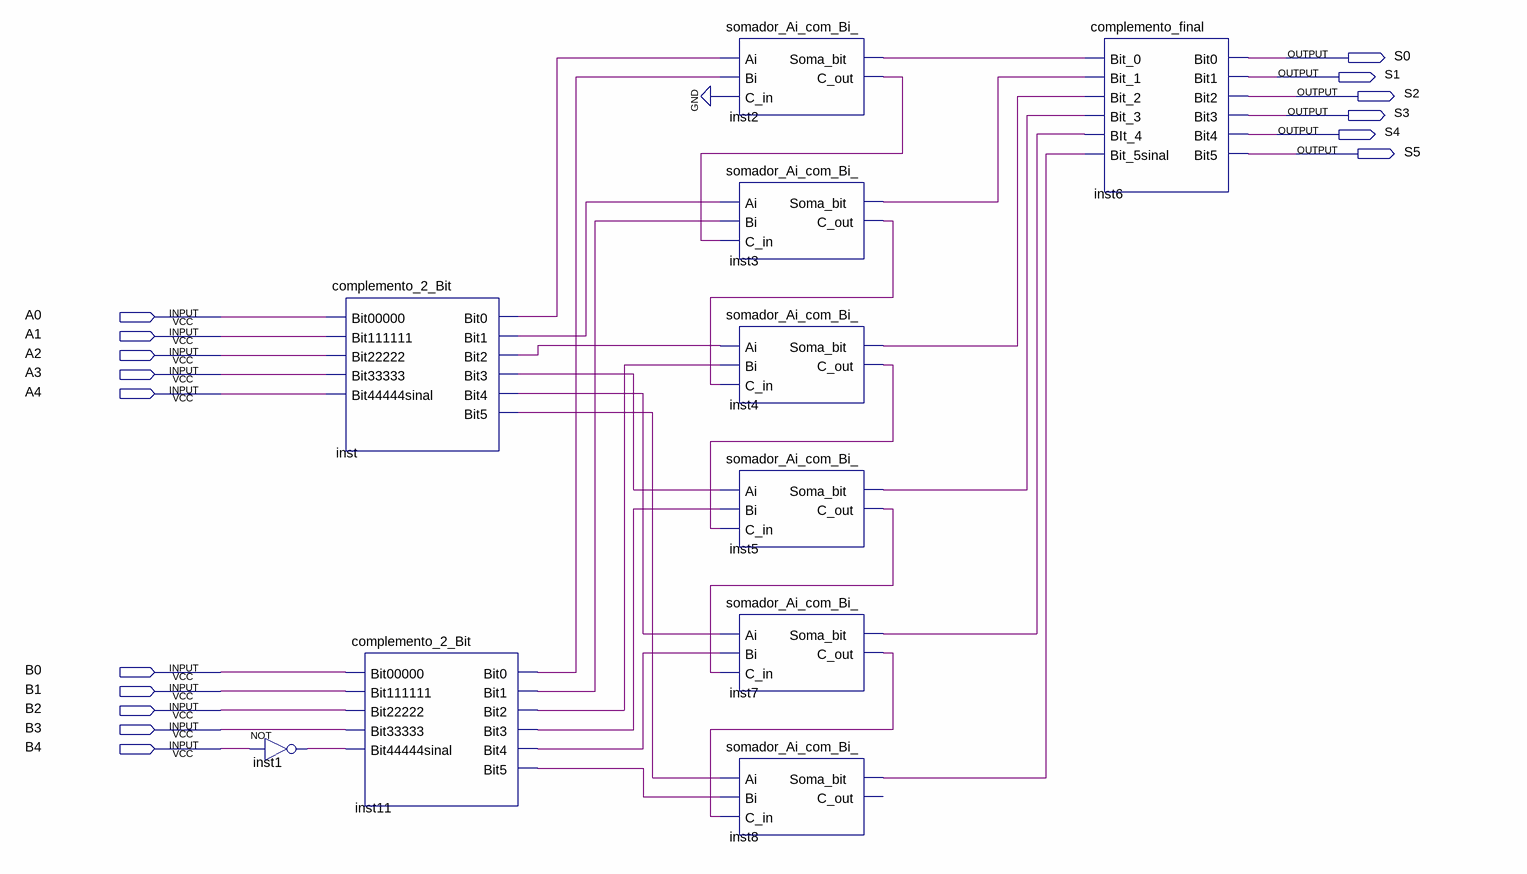
[diagram p0: schematic sheet]
// Quartus schematic subtractor.bdf as structural Verilog: 10 symbols, 16 pins
module subtractor (
  input  A0,
  input  A1,
  input  A2,
  input  A3,
  input  A4,
  input  B0,
  input  B1,
  input  B2,
  input  B3,
  input  B4,
  output S0,
  output S1,
  output S2,
  output S3,
  output S4,
  output S5
);

  wire inst1_out, inst2_c_out, inst2_soma_bit, inst3_c_out, inst3_soma_bit, inst4_c_out, inst4_soma_bit,
       inst5_c_out, inst5_soma_bit, inst7_c_out, inst7_soma_bit, inst8_soma_bit, inst11_bit0, inst11_bit1,
       inst11_bit2, inst11_bit3, inst11_bit4, inst11_bit5, inst_bit0, inst_bit1, inst_bit2, inst_bit3,
       inst_bit4, inst_bit5;

  not inst1 (inst1_out, B4);
  complemento_2_Bit inst (
    .Bit00000(A0), .Bit111111(A1), .Bit22222(A2), .Bit33333(A3), .Bit44444sinal(A4), .Bit0(inst_bit0),
    .Bit1(inst_bit1), .Bit2(inst_bit2), .Bit3(inst_bit3), .Bit4(inst_bit4), .Bit5(inst_bit5));
  complemento_2_Bit inst11 (
    .Bit00000(B0), .Bit111111(B1), .Bit22222(B2), .Bit33333(B3), .Bit44444sinal(inst1_out),
    .Bit0(inst11_bit0), .Bit1(inst11_bit1), .Bit2(inst11_bit2), .Bit3(inst11_bit3), .Bit4(inst11_bit4),
    .Bit5(inst11_bit5));
  somador_Ai_com_Bi_ inst2 (
    .Ai(inst_bit0), .Bi(inst11_bit0), .C_in(1'b0), .Soma_bit(inst2_soma_bit), .C_out(inst2_c_out));
  somador_Ai_com_Bi_ inst3 (
    .Ai(inst_bit1), .Bi(inst11_bit1), .C_in(inst2_c_out), .Soma_bit(inst3_soma_bit), .C_out(inst3_c_out));
  somador_Ai_com_Bi_ inst4 (
    .Ai(inst_bit2), .Bi(inst11_bit2), .C_in(inst3_c_out), .Soma_bit(inst4_soma_bit), .C_out(inst4_c_out));
  somador_Ai_com_Bi_ inst5 (
    .Ai(inst_bit3), .Bi(inst11_bit3), .C_in(inst4_c_out), .Soma_bit(inst5_soma_bit), .C_out(inst5_c_out));
  somador_Ai_com_Bi_ inst7 (
    .Ai(inst_bit4), .Bi(inst11_bit4), .C_in(inst5_c_out), .Soma_bit(inst7_soma_bit), .C_out(inst7_c_out));
  somador_Ai_com_Bi_ inst8 (
    .Ai(inst_bit5), .Bi(inst11_bit5), .C_in(inst7_c_out), .Soma_bit(inst8_soma_bit));  // open: C_out
  complemento_final inst6 (
    .Bit_0(inst2_soma_bit), .Bit_1(inst3_soma_bit), .Bit_2(inst4_soma_bit), .Bit_3(inst5_soma_bit),
    .BIt_4(inst7_soma_bit), .Bit_5sinal(inst8_soma_bit), .Bit0(S0), .Bit1(S1), .Bit2(S2), .Bit3(S3),
    .Bit4(S4), .Bit5(S5));
endmodule
